# Altium project hand_main_v2.PrjPcb (part 2 of 2)

## Sheet hand_pdn_v2.SchDoc
size 762 x 381 mm; SheetNumber: 2; SheetTotal: 2; SPICEModelCacheLCJNLKZJ: <root> / <DocumentId>LCJNLKZJ</DocumentId> / </root>
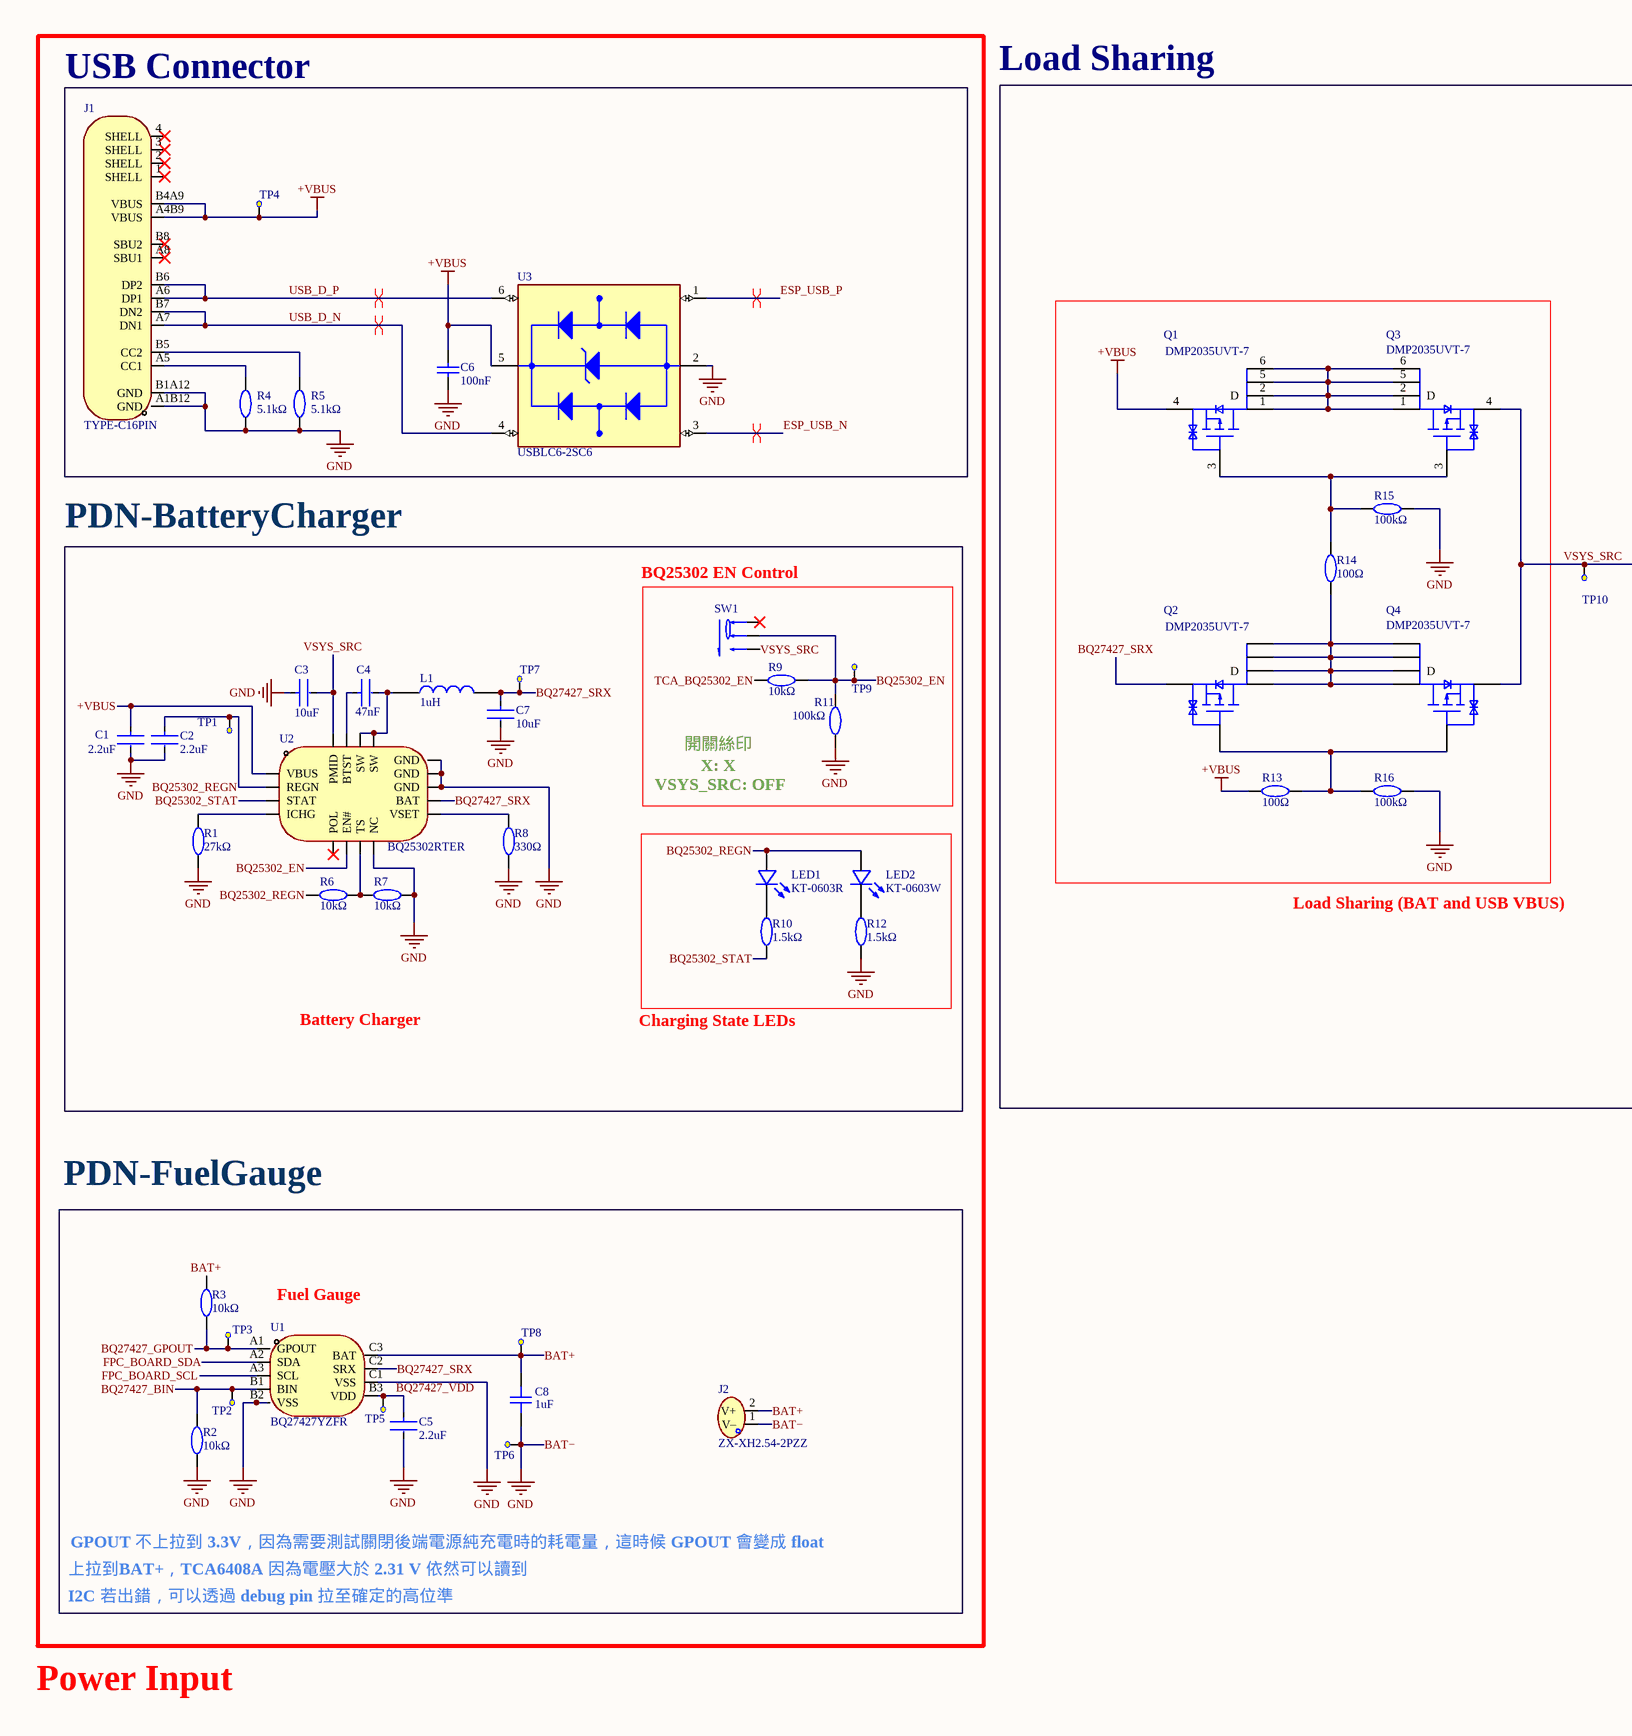
[diagram p3: hand_pdn_v2.SchDoc, left]
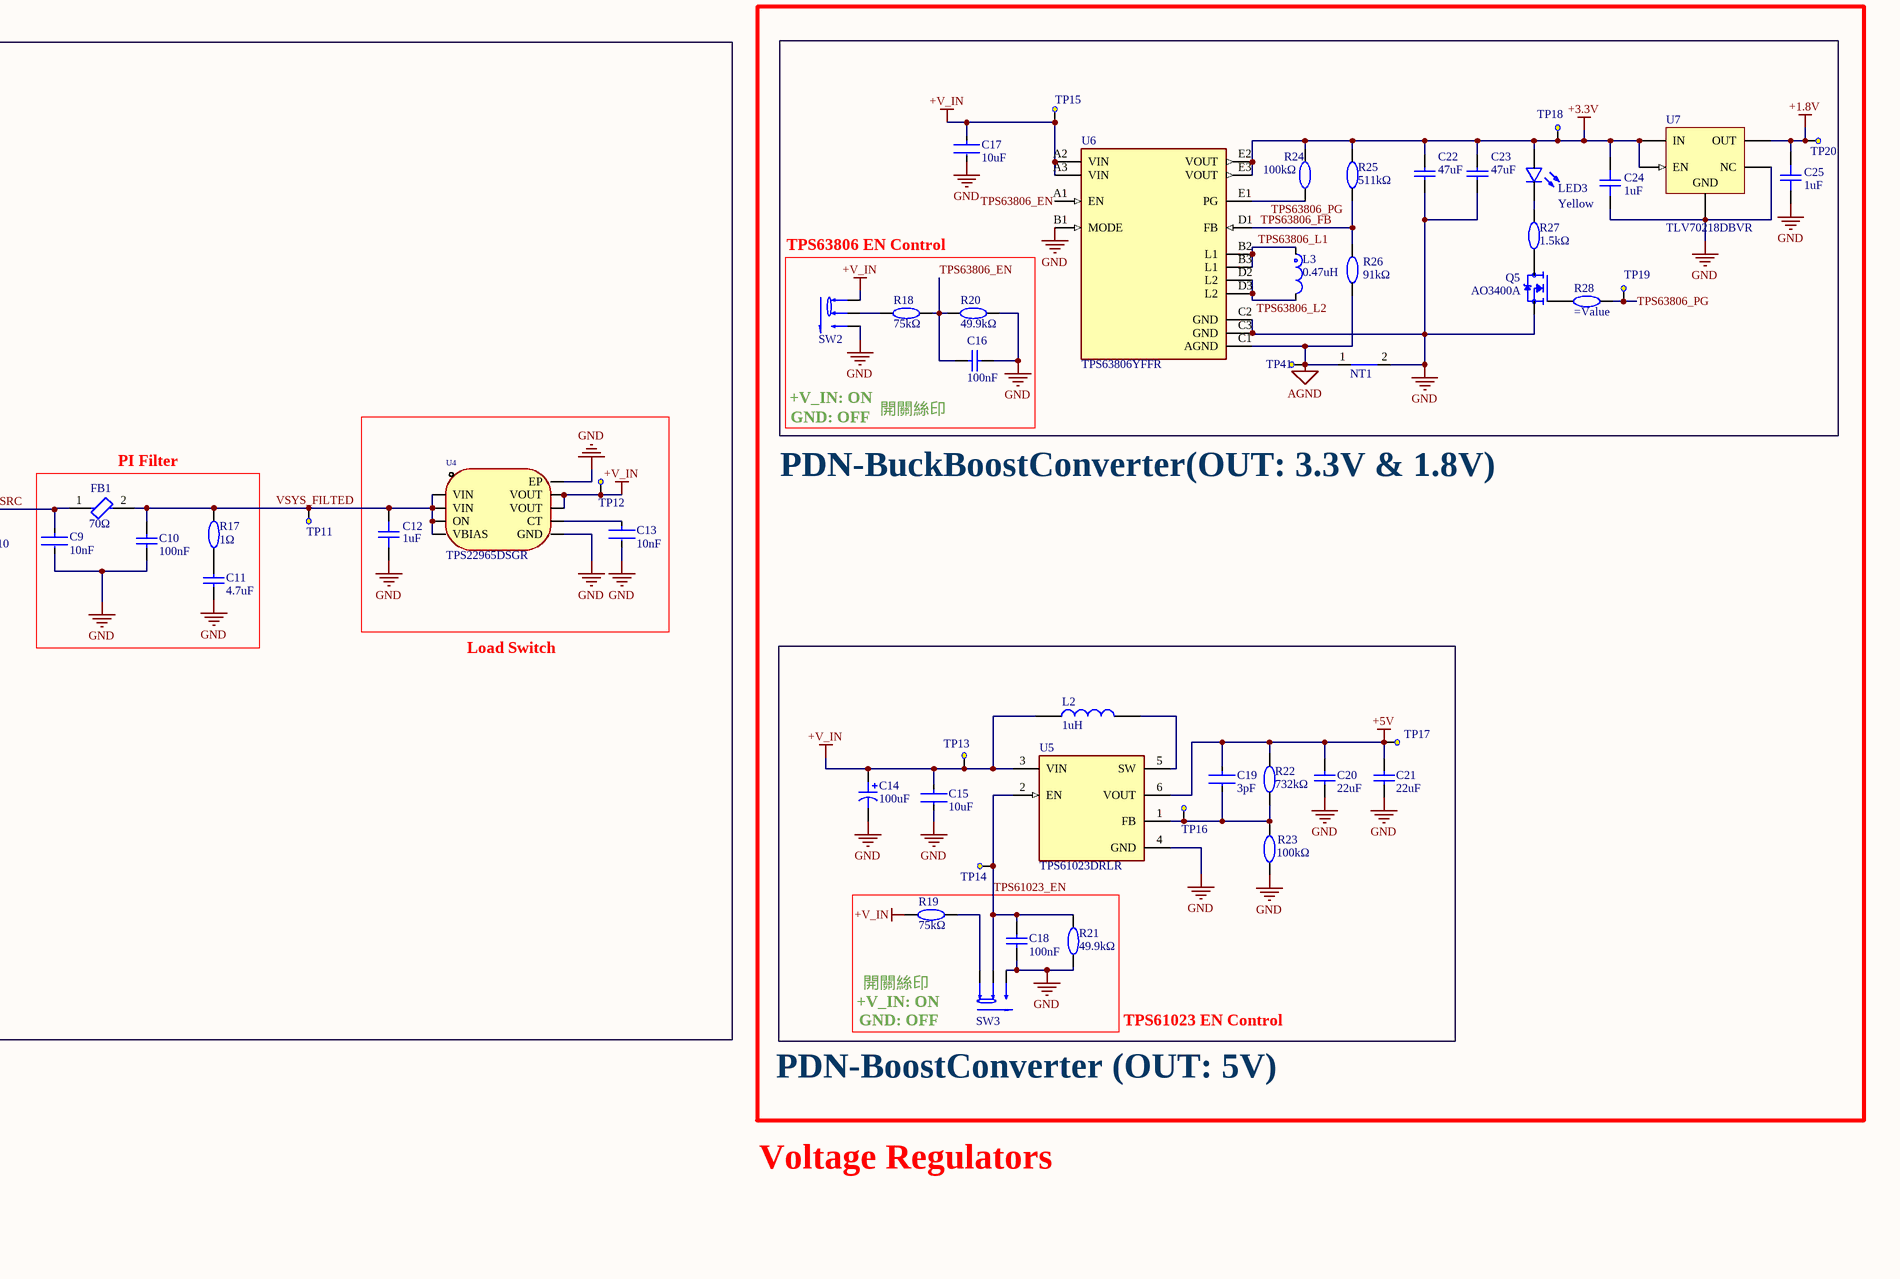
[diagram p4: hand_pdn_v2.SchDoc, right]

### Parts
C1  2.2uF  [FP-CL10-IPC_A]
C2  2.2uF  [FP-CL10-IPC_A]
C3  10uF  [FP-CL10-IPC_A]
C4  47nF  [FP-CL579-IPC_A]
C5  2.2uF  [FP-CL10-IPC_A]
C6  100nF  [CAPC1050X55X23NL05T13]
C7  10uF  [FP-CL10-IPC_A]
C8  1uF  [C0402]
C9  10nF  [FP-CL165-IPC_B]
C10  100nF  [CAPC1050X55X23NL05T13]
C11  4.7uF  [C0603]
C12  1uF  [C0402]
C13  10nF  [FP-CL165-IPC_B]
C14  100uF  [CAP-SMD_BD6.3-L6.6-W6.6-LS7.2-FD]
C15  10uF  [FP-CL10-IPC_A]
C16  100nF  [CAPC1050X55X23NL05T13]
C17  10uF  [FP-CL10-IPC_A]
C18  100nF  [CAPC1050X55X23NL05T13]
C19  3pF  [FP-GJM155-0_05-IPC_C]
C20  22uF  [CAPC2013X140X45ML15T25]
C21  22uF  [CAPC2013X140X45ML15T25]
C22  47uF  [C0805]
C23  47uF  [C0805]
C24  1uF  [C0402]
C25  1uF  [C0402]
FB1  70Ω  [FP-BLM18-0_15-t0_5-d1_2-IPC_B]
J1  TYPE-C16PIN  [USB-C-SMD_TYPE-C16PIN]
J2  ZX-XH2.54-2PZZ  [CONN-TH_2P-P2.50_HX25003-2A]
L1  1uH  [XEL4030101MED]
L2  1uH  [XEL4030101MED]
L3  0.47uH  [FP-XFL4015-MFG]
LED1  KT-0603R  [LED0603-RD]
LED2  KT-0603W  [LED0603-R-RD_WHITE]
LED3  Name: Yellow  [LED0603-RD-YELLOW]  (hidden comment: 19-213/Y2C-CQ2R2L/3T(CY))
NT1  NT  [NT]  (value not drawn)  (net tie, no BOM)
Q1  DMP2035UVT-7  [SOT-26_L3.0-W1.6-P0.95-LS2.8-BL]
Q2  DMP2035UVT-7  [SOT-26_L3.0-W1.6-P0.95-LS2.8-BL]
Q3  DMP2035UVT-7  [SOT-26_L3.0-W1.6-P0.95-LS2.8-BL]
Q4  DMP2035UVT-7  [SOT-26_L3.0-W1.6-P0.95-LS2.8-BL]
Q5  AO3400A  [FP-SOT23-IPC_A]
R1  27kΩ  [R0603]
R2  10kΩ  [R0402]
R3  10kΩ  [R0402]
R4  5.1kΩ  [R0402]
R5  5.1kΩ  [R0402]
R6  10kΩ  [R0402]
R7  10kΩ  [R0402]
R8  330Ω  [R0402]
R9  10kΩ  [R0402]
R10  1.5kΩ  [R0402]
R11  100kΩ  [R0402]
R12  1.5kΩ  [R0402]
R13  100Ω  [R0603]
R14  100Ω  [R0603]
R15  100kΩ  [R0402]
R16  100kΩ  [R0402]
R17  1Ω  [R0805]
R18  75kΩ  [R0603]
R19  75kΩ  [R0603]
R20  49.9kΩ  [R0603]
R21  49.9kΩ  [R0603]
R22  732kΩ  [R0603]
R23  100kΩ  [R0402]
R24  100kΩ  [R0402]
R25  511kΩ  [R0603]
R26  91kΩ  [R0402]
R27  1.5kΩ  [R0402]
R28  (no value)  [R0402]
SW1  MST-22D18G2 3J  [SW-SMD_SHOUHAN_MST-22D18G23J_C2875122]  (value not drawn)
SW2  MST-22D18G2 3J  [SW-SMD_SHOUHAN_MST-22D18G23J_C2875122]  (value not drawn)
SW3  MST-22D18G2 3J  [SW-SMD_SHOUHAN_MST-22D18G23J_C2875122]  (value not drawn)
TP1  Test point  [Test_Point]  (value not drawn)
TP2  Test point  [Test_Point]  (value not drawn)
TP3  Test point  [Test_Point]  (value not drawn)
TP4  Test point  [Test_Point]  (value not drawn)
TP5  Test point  [Test_Point]  (value not drawn)
TP6  Test point  [Test_Point]  (value not drawn)
TP7  Test point  [Test_Point]  (value not drawn)
TP8  Test point  [Test_Point]  (value not drawn)
TP9  Test point  [Test_Point]  (value not drawn)
TP10  Test point  [Test_Point]  (value not drawn)
TP11  Test point  [Test_Point]  (value not drawn)
TP12  Test point  [Test_Point]  (value not drawn)
TP13  Test point  [Test_Point]  (value not drawn)
TP14  Test point  [Test_Point]  (value not drawn)
TP15  Test point  [Test_Point]  (value not drawn)
TP16  Test point  [Test_Point]  (value not drawn)
TP17  Test point  [Test_Point]  (value not drawn)
TP18  Test point  [Test_Point]  (value not drawn)
TP19  Test point  [Test_Point]  (value not drawn)
TP20  Test point  [Test_Point]  (value not drawn)
TP41  Test point  [Test_Point]  (value not drawn)
U1  BQ27427YZFR  [DSBGA-9_L1.6-W1.6-R3-C3-P0.50-TL]
U2  BQ25302RTER  [WQFN-16_L3.0-W3.0-P0.50-BL-EP1.7]
U3  USBLC6-2SC6  [SOT95P280X145-6N]
U4  TPS22965DSGR  [UDFN-8_L2.0-W2.0-P0.50-TL-EP]
U5  TPS61023DRLR  [FP-DRL0006A-MFG]
U6  TPS63806YFFR  [FP-YFF0015-MFG]
U7  TLV70218DBVR  [DBV0005A_M]

### Blocks framed on the sheet
USB Connector: C6 J1 R4 R5 TP4 U3
Load Sharing: C12 C13 Q1-Q4 R13-R16 TP10-TP12 U4
PI Filter: C9-C11 FB1 R17
PDN-BatteryCharger: C1-C4 C7 L1 LED1 LED2 R1 R6-R12 SW1 TP1 TP7 TP9 U2
PDN-FuelGauge: C5 C8 J2 R2 R3 TP2 TP3 TP5 TP6 TP8 U1

### Nets
+1.8V: C25.2 TP20.TP?(Test_point) U7.5(OUT)
+3.3V: C22.2 C23.2 C24.2 LED3.2(A) R24.2 R25.2 TP18.TP?(Test_point) U6.E2(VOUT) U6.E3(VOUT) U7.1(IN) U7.3(EN)
+5V: C19.1 C20.2 C21.2 R22.2 TP17.TP?(Test_point) U5.6(VOUT)
+V_IN: C14.1 C15.1 C17.1 L2.1 R19.1 SW2.1 TP12.TP?(Test_point) TP13.TP?(Test_point) TP15.TP?(Test_point) U4.7(VOUT) U4.8(VOUT) U5.3(VIN) U6.A2(VIN) U6.A3(VIN)
+VBUS: C1.1 C6.2 J1.A4B9(VBUS) J1.B4A9(VBUS) Q1.4(S) R13.2 TP4.TP?(Test_point) U2.1(VBUS) U3.5(VBUS)
AGND: NT1.1 R26.1 TP41.TP?(Test_point) U6.C1(AGND)
BAT+: C8.2 J2.2(V+) R3.2 TP8.TP?(Test_point) U1.C3(BAT)
GND: C1.2 C2.2 C3.1 C5.2 C6.1 C7.2 C8.1 C9.2 C10.1 C11.1 C12.1 C13.2 C14.2 C15.2 C16.1 C17.2 C18.2 C20.1 C21.1 C22.1 C23.1 C24.1 C25.1 J1.A1B12(GND) J1.B1A12(GND) J2.1(V–) NT1.2 Q5.2(S) R1.1 R2.1 R4.1 R5.1 R7.2 R8.1 R11.1 R12.1 R15.1 R16.1 R20.2 R21.1 R23.1 SW2.3 SW3.3 TP6.TP?(Test_point) U1.B2(VSS) U1.C1(VSS) U2.8(NC) U2.11(GND) U2.12(GND) U2.17(GND) U3.2(GND) U4.5(GND) U4.9(EP) U5.4(GND) U6.B1(MODE) U6.C2(GND) U6.C3(GND) U7.2(GND) U7.4(NC)  [also labelled BAT−]
BQ25302_EN: R9.1 R11.2 SW1.2 TP9.TP?(Test_point) U2.6(EN#)
BQ25302_REGN: C2.1 LED1.2(A) LED2.1(A) R6.1 TP1.TP?(Test_point) U2.2(REGN)
BQ25302_STAT: R10.1 U2.3(STAT)
BQ27427_BIN: R2.2 TP2.TP?(Test_point) U1.B1(BIN)
BQ27427_GPOUT: R3.1 TP3.TP?(Test_point) U1.A1(GPOUT)
BQ27427_SRX: C7.1 L1.2 Q2.4(S) TP7.TP?(Test_point) U1.C2(SRX) U2.10(BAT)
BQ27427_VDD: C5.1 TP5.TP?(Test_point) U1.B3(VDD)
ESP_USB_N: U3.3(I/O2_IN)
ESP_USB_P: U3.1(I/O1_IN)
FPC_BOARD_SCL: U1.A3(SCL)
FPC_BOARD_SDA: U1.A2(SDA)
TCA_BQ25302_EN: R9.2
TPS61023_EN: C18.1 R21.2 SW3.2 TP14.TP?(Test_point) U5.2(EN)
TPS63806_EN: C16.2 R18.2 R20.1 U6.A1(EN)
TPS63806_FB: R25.1 R26.2 U6.D1(FB)
TPS63806_L1: L3.1 U6.B2(L1) U6.B3(L1)
TPS63806_L2: L3.2 U6.D2(L2) U6.D3(L2)
TPS63806_PG: R24.1 R28.2 TP19.TP?(Test_point) U6.E1(PG)
USB_D_N: J1.A7(DN1) J1.B7(DN2) U3.4(I/O2_OUT)
USB_D_P: J1.A6(DP1) J1.B6(DP2) U3.6(I/O1_OUT)
VSYS_FILTED: C10.2 C12.2 FB1.2 R17.2 TP11.TP?(Test_point) U4.1(VIN) U4.2(VIN) U4.3(ON) U4.4(VBIAS)
VSYS_SRC: C3.2 C9.1 FB1.1 Q3.4(S) Q4.4(S) SW1.3 TP10.TP?(Test_point) U2.16(PMID)
NetC4_1: C4.1 U2.15(BTST)
NetC4_2: C4.2 L1.1 U2.13(SW) U2.14(SW)
NetC11_2: C11.2 R17.1
NetC13_1: C13.1 U4.6(CT)
NetC19_2: C19.2 R22.1 R23.2 TP16.TP?(Test_point) U5.1(FB)
NetJ1_A5: J1.A5(CC1) R4.2
NetJ1_B5: J1.B5(CC2) R5.2
NetL2_2: L2.2 U5.5(SW)
NetLED1_1: LED1.1(K) R10.2
NetLED2_2: LED2.2(K) R12.2
NetLED3_1: LED3.1(C) R27.2
NetQ1_1: Q1.1(D) Q1.2(D) Q1.5(D) Q1.6(D) Q3.1(D) Q3.2(D) Q3.5(D) Q3.6(D)
NetQ1_3: Q1.3(G) Q3.3(G) R14.2 R15.2
NetQ2_1: Q2.1(D) Q2.2(D) Q2.5(D) Q2.6(D) Q4.1(D) Q4.2(D) Q4.5(D) Q4.6(D) R14.1
NetQ2_3: Q2.3(G) Q4.3(G) R13.1 R16.2
NetQ5_1: Q5.1(G) R28.1
NetQ5_3: Q5.3(D) R27.1
NetR1_2: R1.2 U2.4(ICHG)
NetR6_2: R6.2 R7.1 U2.7(TS)
NetR8_2: R8.2 U2.9(VSET)
NetR18_1: R18.1 SW2.2
NetR19_2: R19.2 SW3.1

Not connected (* = marked no-connect by the designer): J1 1(SHELL)* 2(SHELL)* 3(SHELL)* 4(SHELL)* A8(SBU1)* B8(SBU2)*; SW1 1*; U2 5(POL)*

### Layout directives
differential pair: ESP_USB_N, ESP_USB_P, USB_D_N, USB_D_P

### Notes on the sheet
- TPS63806 EN Control
- +V_IN: ON
- GND: OFF
- 開關絲印
- (near SW1) BQ25302 EN Control
- PDN-BuckBoostConverter(OUT: 3.3V & 1.8V)
- Load Switch
- VSYS_SRC: OFF
- X: X
- Load Sharing (BAT and USB VBUS)
- Battery Charger
- Charging State LEDs
- TPS61023 EN Control
- PDN-BoostConverter (OUT: 5V)
- Voltage Regulators
- Fuel Gauge
- I2C 若出錯，可以透過 debug pin 拉至確定的高位準
- 上拉到BAT+，TCA6408A 因為電壓大於 2.31 V 依然可以讀到
- GPOUT 不上拉到 3.3V，因為需要測試關閉後端電源純充電時的耗電量，這時候 GPOUT 會變成 float
- Power Input

### Library data of the parts
C1 C2 C5 = CL10A225KO8NNNC: Cap Ceramic 2.2uF 16V X5R ±10% Pad SMD 0603 +85°C T/R; Case Code (Metric): 1608; Height: 0.8mm; Case/Package: 0603; Depth: 0.8mm; Capacitance: 2.2uF; Voltage Rating: 16V; Case Code (Imperial): 0603; Length: 1.6mm; Packaging: Tape and Reel; Material: Ceramic; Lead Free: Lead Free; Max Operating Temperature: 85°C; Contact Plating: Tin; Thickness: 0.035inch; Radiation Hardening: No; Tolerance: 10%; Min Operating Temperature: -55°C; Voltage: 16V; Dielectric: X5R; Mount: Surface Mount; Package Quantity: 4000; Width: 0.031inch; Voltage Rating (DC): 16V
C3 C7 C15 C17 = CL10A106MA8NRNC: Cap Ceramic 10uF 25V X5R ±20% Pad SMD 0603 +85°C T/R; Width: 0.031inch; Voltage Rating: 25V; Length: 0.063inch; Case Code (Metric): 1608; Dielectric: X5R; Termination: Wraparound; Capacitance: 10uF; Lead Free: Lead Free; Mount: Surface Mount; Package Quantity: 1; Case Code (Imperial): 0603; Thickness: 0.035inch; Packaging: Tape and Reel; Contact Plating: Tin; Min Operating Temperature: -55°C; Tolerance: 20%; Max Operating Temperature: 85°C; Case/Package: 0603
C4 = CL05B473KO5NNNC: Cap Ceramic 47nF 16V X7R ±10% SMD 0402 +125°C Paper T/R; Voltage Rating (DC): 16V; Mount: Surface Mount; Max Operating Temperature: 125°C; Radiation Hardening: No; Voltage: 16V; Capacitance: 47nF; Length: 1mm; Package Quantity: 1; Tolerance: 10%; Width: 0.02inch; Case/Package: 0402; Case Code (Metric): 1005; Height: 0.5mm; Packaging: Tape and Reel; Depth: 0.5mm; Lead Free: Lead Free; Min Operating Temperature: -55°C; Case Code (Imperial): 0402; Voltage Rating: 16V; Contact Plating: Tin; Dielectric: X7R; Thickness: 0.022inch
C6 C10 C16 C18 = CL05B104KO5NNNC: Chip Capacitor, 100 nF, +/- 10%, 16 V, -55 to 125 degC, 0402 (1005 Metric), RoHS, Tape and Reel; Manufacturer: Samsung Electro-Mechanics; Capacitance: 100000pF; Dielectric: X7R; Rated Voltage: 16V; Case Size/Dimension: 0402; Tolerance (%): ±10%; Manufacturer URL: http://www.samsungsem.com/global/index.jsp; Datasheet URL: https://datasheet.ciiva.com/29198/458718-da-01-en-vs-kondensator-0402-29198423.pdf; Datasheet Version: Nov-10
C8 C12 C24 C25 = CL05A105KA5NQNC: MLCC, 1 uF, 25 V, ± 10%, X5R, 0402 [1005 Metric]; Manufacturer: SAMSUNG(三星); Add into BOM: yes; Voltage Rated: 25V; Symbol: CL05A105KA5NQNC; Device: CL05A105KA5NQNC; LCSC Part Name: 1uF ±10% 25V; Supplier Part: C52923; Manufacturer Part: CL05A105KA5NQNC; Supplier Footprint: 0402; JLCPCB Part Class: Basic Part; Datasheet: https://atta.szlcsc.com/upload/public/pdf/source/20160218/1457707763339.pdf; Supplier: LCSC; Convert to PCB: yes; Value: 1uF; Tolerance: ±10%; Temperature Coefficient: X5R; Name: 1uF
C9 C13 = CL05B103KB5NNNC: Cap Ceramic 10nF 50V X7R ±10% SMD 0402 +125°C Paper T/R; Depth: 0.5mm; Length: 1mm; Lead Free: Lead Free; Case Code (Metric): 1005; Width: 0.02inch; Min Operating Temperature: -55°C; Thickness: 0.022inch; Package Quantity: 1; Mount: Surface Mount; Height: 0.5mm; Voltage: 50V; Material: Ceramic; Tolerance: 10%; Case Code (Imperial): 0402; Radiation Hardening: No; Case/Package: 0402; Max Operating Temperature: 125°C; Voltage Rating (DC): 50V; Contact Plating: Tin; Packaging: Tape and Reel; Voltage Rating: 50V; Capacitance: 10nF; Dielectric: X7R
C11 = CL10A475KO8NNNC: Multilayer Ceramic Capacitor, 4.7 uF, 16 V, ± 10%, X5R, 0603 [1608 Metric]; Manufacturer: SAMSUNG(三星); Add into BOM: yes; Voltage Rated: 16V; Symbol: CL10A475KO8NNNC; Device: CL10A475KO8NNNC; Supplier: LCSC; Manufacturer Part: CL10A475KO8NNNC; Value: 4.7uF; Supplier Part: C19666; JLCPCB Part Class: Basic Part; LCSC Part Name: 4.7uF ±10% 16V; Supplier Footprint: 0603; Datasheet: https://atta.szlcsc.com/upload/public/pdf/source/20160218/1457707763339.pdf; Convert to PCB: yes; Tolerance: ±10%; Temperature Coefficient: X5R; Name: 4.7uF
C14 = RVE100UF16V67RV0046: 100uF 16V SMD, D6.3xL5.4mm Aluminum Electrolytic Capacitors - SMD ROHS; Manufacturer: KNSCHA(科尼盛); Add into BOM: yes; Tolerance: ±20%; Ripple Current: 170mA@120Hz; Equivalent Series Resistance(ESR): 850mΩ@100kHz; φD: 6.3mm; L: 5.4mm; Lifetime @ Temp: 2000hrs@105℃; Symbol: RVE100UF16V67RV0046; Device: RVE100UF16V67RV0046; Supplier: LCSC; Supplier Part: C2904878; Manufacturer Part: RVE100UF16V67RV0046; Value: 100uF; JLCPCB Part Class: 扩展库; LCSC Part Name: 100uF ±20% 16V; Supplier Footprint: SMD,D6.3xL5.4mm; Datasheet: https://atta.szlcsc.com/upload/public/pdf/source/20211014/E793867481A07AC3B19BA2A562D53862.pdf; Convert to PCB: yes; Rated Voltage: 16V; Operating Temperature: -55℃~+105℃; Name: 100uF
C19 = GJM1555C1H3R0WB01D: Multi-Layer Ceramic Capacitor 3pF C0G  ±0.05pF 0402 Paper T/R; Voltage Rating: 50V; Case Code (Imperial): 0402; Capacitance: 3pF; Radiation Hardening: No; Max Operating Temperature: 125°C; Case/Package: 0402; Length: 1mm; Depth: 0.5mm; Min Operating Temperature: -55°C; Mount: Surface Mount; Dielectric: C0G; Thickness: 0.022inch; Width: 0.5mm; Voltage Rating (DC): 50V; Case Code (Metric): 1005; Height: 0.5mm; Packaging: Tape and Reel; Termination: SMD/SMT; Package Quantity: 10000
C20 C21 = CL21A226MAQNNNE: Multi-layer Ceramic Capacitor, 22 uF, -55 to 85 degC, 2-Pin SMD (0805), RoHS, Tape and Reel; Manufacturer: Samsung Electro-Mechanics; Voltage - Rated: 25V; Other Names: 1276-2908-2; Capacitance: 22µF; Featured Product: Multi-LayerCeramicCapacitors; Product Training Modules: HighCapMLCCFamily; Temperature Coefficient: X5R; Tolerance: ±20%; Online Catalog: CLSeries,HighCapacitance; Applications: GeneralPurpose; RoHS Information: MLCCRoHS2Compliance; Height - Seated (Max): -; Lead Style: -; Lead Spacing: -; Datasheet URL: http://datasheet.octopart.com/CL21A226MAQNNNE-Samsung-datasheet-48647558.pdf; Size / Dimension: 0.079"Lx0.049"W(2.00mmx1.25mm); Thickness (Max): 0.055"(1.40mm); Family: CeramicCapacitors; Package Description: 2-Pin Surface Mount Device, Body 2.0 x 1.25 mm; Datasheet Version: 07/2015; Packaging: Tape&Reel(TR); Manufacturer URL: http://www.samsungsem.com/global/index.jsp; Ratings: -; Package / Case: 0805(2012Metric); Standard Package: 2,000; Mounting Type: SurfaceMount,MLCC; Mounting Technology: SurfaceMount; Category: Capacitors; Package Reference: 0805; Series: CL; Features: -; Operating Temperature: -55°C~85°C
C22 C23 = CL21A476MQYNNNE: MLCC, 47 uF, 6.3 V, ± 20%, X5R, 0805 [2012 Metric]; Manufacturer: SAMSUNG(三星); Add into BOM: yes; Voltage Rated: 6.3V; Symbol: CL21A476MQYNNNE; Device: CL21A476MQYNNNE; Supplier: LCSC; Manufacturer Part: CL21A476MQYNNNE; Value: 47uF; Supplier Part: C16780; JLCPCB Part Class: Basic Part; LCSC Part Name: 47uF ±20% 6.3V; Supplier Footprint: 0805; Datasheet: https://atta.szlcsc.com/upload/public/pdf/source/20160218/1457707763339.pdf; Convert to PCB: yes; Tolerance: ±20%; Temperature Coefficient: X5R; Name: 47uF
FB1 = BLM18SG700TZ1D: Chip Ferrite Bead, 0603, 70Ω @ 100MHz, 25%, 0.02Ω, 4A; RoHS Compliant: Yes
J1 = TYPE-C16PIN: USB Type-C 16 pins connector; Manufacturer: SHOU HAN(首韩); Add into BOM: yes; Gender: 母; Number of Ports: 1; Number of Contacts: 16P; Current Rating - Power (Max): 3A; Symbol: TYPE-C16PIN; Device: TYPE-C16PIN; Supplier: LCSC; Supplier Part: C393939; Manufacturer Part: TYPE-C16PIN; JLCPCB Part Class: Extended Part; LCSC Part Name: Type-C 母 卧贴; Supplier Footprint: SMD; Datasheet: https://atta.szlcsc.com/upload/public/pdf/source/20190521/C393939_7B9043D4CF1026AF443AB60D91FBCD5C.pdf; Convert to PCB: yes; Connector Type: Type-C; Standard: -; Mounting Style: 卧贴; Operating Temperature Range: -40℃~+85℃; Name: TYPE-C16PIN
J2 = ZX-XH2.54-2PZZ: XH-2.54 2 Pin, through hole; Manufacturer: Megastar(兆星); Add into BOM: yes; Pins Structure: 1x2P; Pitch: 2.54mm; Reference Series: XH; Number of PINs Per Row: 2; Current Rating (Max): 3A; Symbol: ZX-XH2.54-2PZZ; Device: ZX-XH2.54-2PZZ; Supplier: LCSC; Supplier Part: C7429632; Manufacturer Part: ZX-XH2.54-2PZZ; JLCPCB Part Class: 扩展库; LCSC Part Name: ZX-XH2.54-2PZZ; Supplier Footprint: 插件,P=2.54mm; Datasheet: https://atta.szlcsc.com/upload/public/pdf/source/20230619/19BA6947230AA44A04D3EDD65E618FD0.pdf; Convert to PCB: yes; Mounting Style: 直插; Number of Pins: 2P; Number of Rows: 1; Row Spacing: -; Contact Material: 黄铜; Contact Plating: 锡; Operating Temperature Range: -25℃~+85℃; Name: ZX-XH2.54-2PZZ
L1 L2 = XEL4030-102MEC: Power inductor, shielded, 20% tol, SMT, RoHS, halogen-free; Manufacturer_Name: COILCRAFT; Datasheet Link: https://www.coilcraft.com/pdfs/xel4030.pdf; Height: 3.2mm; Manufacturer_Part_Number: XEL4030-102MEC; Mouser Part Number: 994-XEL4030-102MEC; Mouser Price/Stock: https://www.mouser.co.uk/ProductDetail/Coilcraft/XEL4030-102MEC?qs=chTDxNqvsynxP6L4IWrGOQ%3D%3D; Value: 1uH
L3 = XFL4015-471MEC: Shielded Power Fixed Inductor 0.47µH 11.2A 8.36mOhm AECQ2, SFR 89MHz; DC Resistance (DCR): 8.36mR; Inductance: 470nH; Test Frequency: 100kHz; Tolerance: 20%; Core Material: Composite; Width: 4.3mm; Shielding: Shielded; Length: 4.3mm; Max DC Current: 11.2A; Series: XFL4015; RoHS Compliant: Yes; Min Operating Temperature: -40°C; Packaging: Tape and Reel; Self Resonant Frequency: 89MHz; Termination: SMD/SMT; Max Operating Temperature: 125°C; Height: 1.6mm; Package Quantity: 1000; Lead Free: Contains Lead
LED1 = KT-0603R: LED, Red 0603; Manufacturer: KENTO; Add into BOM: yes; Emitted Color: 红色; Symbol: KT-0603R; Device: KT-0603R; LCSC Part Name: 0603 红灯 高亮; Supplier Part: C2286; Manufacturer Part: KT-0603R; Supplier Footprint: 0603; JLCPCB Part Class: 基础库; Datasheet: https://atta.szlcsc.com/upload/public/pdf/source/20160616/1466072038404.pdf; Supplier: LCSC; Convert to PCB: yes; Power Dissipation: -; Forward Current: -; Dominant Wavelength: -; Peak Wavelength: -; Diode Configuration: -; Lens Color: -; Color Temperature: -; Viewing Angle: -; Mounting Sytle: -; Operating Temperature: -40℃~+85℃; Name: KT-0603R
LED2 = KT-0603W: LED, White 0603; Manufacturer: KENTO; Symbol: 0603White light_C2290; Add into BOM: yes; Emitted Color: 白色; Device: KT-0603W; LCSC Part Name: 0603 白灯 高亮; Supplier Part: C2290; Manufacturer Part: KT-0603W; Supplier Footprint: 0603; JLCPCB Part Class: 基础库; Datasheet: https://atta.szlcsc.com/upload/public/pdf/source/20221101/4C23D5C85BA051E44A00B833D0A41468.pdf; Supplier: LCSC; Convert to PCB: yes; Name: KT-0603W
LED3 = 19-213/Y2C-CQ2R2L/3T(CY): LED, Yellow 0603; Manufacturer: EVERLIGHT(亿光); Add into BOM: yes; Emitted Color: 黄灯; Lens Color: 无色透明; Dominant Wavelength: 585.5nm~591.5nm; Peak Wavelength: 591nm; Forward Current: 20mA; Power Dissipation: 60mW; Viewing Angle: 120°; Symbol: 19-213/Y2C-CQ2R2L/3T(CY); Device: 19-213/Y2C-CQ2R2L/3T(CY); LCSC Part Name: 黄灯; Supplier Part: C72038; Manufacturer Part: 19-213/Y2C-CQ2R2L/3T(CY); Supplier Footprint: 0603; JLCPCB Part Class: 基础库; Datasheet: https://atta.szlcsc.com/upload/public/pdf/source/20160507/1462613613586.pdf; Supplier: LCSC; Convert to PCB: yes; Diode Configuration: -; Color Temperature: -; Mounting Sytle: -; Operating Temperature: -40℃~+85℃; Value: *; Info: Yellow
NT1 = NetTie_SMD
Q1-Q4 = DMP2035UVT-7: P-Channel 20 V 35 mOhm Surface Mount Enhancement Mode Mosfet - TSOT26-6; Manufacturer: DIODES(美台); Add into BOM: yes; Type: 1个P沟道; Drain Source Voltage (Vdss): 20V; Continuous Drain Current (Id): 6A; Power Dissipation (Pd): 1.2W; Drain Source On Resistance (RDS(on)@Vgs,Id): 35mΩ@4.5V,4A; Gate Threshold Voltage (Vgs(th)@Id): 1.5V@250uA; Total Gate Charge (Qg@Vgs): 23.1nC@4.5V; Input Capacitance (Ciss@Vds): 2.4nF@10V; Symbol: DMP2035UVT-7; Device: DMP2035UVT-7; LCSC Part Name: 1个P沟道 耐压:20V 电流:6A; Supplier Part: C260934; Manufacturer Part: DMP2035UVT-7; Supplier Footprint: TSOT-23-6; JLCPCB Part Class: 扩展库; Datasheet: https://atta.szlcsc.com/upload/public/pdf/source/20180725/C260934_EBD02C3987C7A81956B20CBEFFB2DB19.pdf; Supplier: LCSC; Convert to PCB: yes; Operating Temperature: -55℃~+150℃@(Tj); Name: DMP2035UVT-7
Q5 = AO3400A: MOSFET N-CH 30V 5.7A SOT23, C20917, Vth from 0.65 - 1.45 V; Input Capacitance: 630pF; Number of Elements: 1; Rds On Max: 26.5mR; Max Power Dissipation: 1.4W; Gate to Source Voltage (Vgs): 12V; Min Operating Temperature: -55°C; Lead Free: Lead Free; Number of Pins: 3; Drain to Source Voltage (Vdss): 30V; Case/Package: SOT-23; Mount: Surface Mount; Continuous Drain Current (ID): 5.7A; Radiation Hardening: No; Packaging: Tape and Reel; Max Operating Temperature: 150°C; Power Dissipation: 1.4W
R1 = 0603WAF2702T5E: Resistor, Res Thick Film 0603 27K Ohm 1% 0.1W ±100ppm/°C Pad SMD T/R; Manufacturer: UNI-ROYAL(厚声); Add into BOM: yes; Power(Watts): 100mW; Overload Voltage (Max): 75V; Temperature Coefficient: ±100ppm/℃; Symbol: 0603WAF2702T5E; Device: 0603WAF2702T5E; Supplier: LCSC; Manufacturer Part: 0603WAF2702T5E; Supplier Part: C22967; Value: 27kΩ; JLCPCB Part Class: 基础库; LCSC Part Name: 27kΩ ±1% 100mW 厚膜电阻; Supplier Footprint: 0603; Datasheet: https://atta.szlcsc.com/upload/public/pdf/source/20200306/C422600_1E6D84923E4A46A82E41ADD87F860B5C.pdf; Convert to PCB: yes; Type: 厚膜电阻; Tolerance: ±1%; Operating Temperature Range: -55℃~+155℃; Name: 27kΩ
R2 R3 R6 R7 R9 = 0402WGF1002TCE: Resistor, Res Thick Film 0402 10K Ohm 1% 0.063W(1/16W) ±100ppm/°C Pad SMD T/R; Manufacturer: UNI-ROYAL(厚声); Add into BOM: yes; Power(Watts): 62.5mW; Overload Voltage (Max): 50V; Temperature Coefficient: ±100ppm/℃; Symbol: 0402WGF1002TCE; Device: 0402WGF1002TCE; Supplier: LCSC; Manufacturer Part: 0402WGF1002TCE; Supplier Part: C25744; Value: 10kΩ; JLCPCB Part Class: 基础库; LCSC Part Name: 10kΩ ±1% 62.5mW 厚膜电阻; Supplier Footprint: 0402; Datasheet: https://atta.szlcsc.com/upload/public/pdf/source/20200306/C422600_1E6D84923E4A46A82E41ADD87F860B5C.pdf; Convert to PCB: yes; Type: 厚膜电阻; Tolerance: ±1%; Operating Temperature Range: -55℃~+155℃; Name: 10kΩ
R4 R5 = 0402WGF5101TCE: Resistor, 0402 1% 5K1; Power Rating: 0.0625W; Resistance: 5.1kohm; Tolerance, Resistance: ± 1%; Series: MC;...  0.004; Manufacturer: UNI-ROYAL(厚声); Add into BOM: yes; Power(Watts): 62.5mW; Overload Voltage (Max): 50V; Temperature Coefficient: ±100ppm/℃; Symbol: 0402WGF5101TCE; Device: 0402WGF5101TCE; Supplier: LCSC; Manufacturer Part: 0402WGF5101TCE; Supplier Part: C25905; Value: 5.1kΩ; JLCPCB Part Class: Basic Part; LCSC Part Name: 5.1kΩ ±1% 62.5mW 厚膜电阻; Supplier Footprint: 0402; Datasheet: https://atta.szlcsc.com/upload/public/pdf/source/20200306/C422600_1E6D84923E4A46A82E41ADD87F860B5C.pdf; Convert to PCB: yes; Tolerance: ±1%; Type: 厚膜电阻; Operating Temperature Range: -55℃~+155℃; Name: 5.1kΩ
R8 = 0402WGF3300TCE: Resistor, Res Thick Film 0402 330 Ohm 1% 0.063W(1/16W) ±100ppm/°C Pad SMD T/R; Manufacturer: UNI-ROYAL(厚声); Add into BOM: yes; Power(Watts): 62.5mW; Overload Voltage (Max): 50V; Temperature Coefficient: ±100ppm/℃; Symbol: 0402WGF3300TCE; Device: 0402WGF3300TCE; Supplier: LCSC; Manufacturer Part: 0402WGF3300TCE; Supplier Part: C25104; Value: 330Ω; JLCPCB Part Class: Basic Part; LCSC Part Name: 330Ω ±1% 62.5mW 厚膜电阻; Supplier Footprint: 0402; Datasheet: https://atta.szlcsc.com/upload/public/pdf/source/20200306/C422600_1E6D84923E4A46A82E41ADD87F860B5C.pdf; Convert to PCB: yes; Type: 厚膜电阻; Tolerance: ±1%; Operating Temperature Range: -55℃~+155℃; Name: 330Ω
R10 R12 R27 = 0402WGF1501TCE: Resistor, Res Thick Film 0402 1.5K Ohm 1% 0.063W(1/16W) ±100ppm/°C Pad SMD T/R; Manufacturer: UNI-ROYAL(厚声); Add into BOM: yes; Power(Watts): 62.5mW; Overload Voltage (Max): 50V; Temperature Coefficient: ±100ppm/℃; Symbol: 0402WGF1501TCE; Device: 0402WGF1501TCE; Supplier: LCSC; Manufacturer Part: 0402WGF1501TCE; Supplier Part: C25867; Value: 1.5kΩ; JLCPCB Part Class: 基础库; LCSC Part Name: 1.5kΩ ±1% 62.5mW 厚膜电阻; Supplier Footprint: 0402; Datasheet: https://atta.szlcsc.com/upload/public/pdf/source/20200306/C422600_1E6D84923E4A46A82E41ADD87F860B5C.pdf; Convert to PCB: yes; Type: 厚膜电阻; Tolerance: ±1%; Operating Temperature Range: -55℃~+155℃; Name: 1.5kΩ
R11 R15 R16 R23 R24 = 0402WGF1003TCE: Resistor, Res Thick Film 0402 100K Ohm 1% 0.063W(1/16W) ±100ppm/°C Pad SMD T/R; Manufacturer: UNI-ROYAL(厚声); Add into BOM: yes; Power(Watts): 62.5mW; Overload Voltage (Max): 50V; Temperature Coefficient: ±100ppm/℃; Symbol: 0402WGF1003TCE; Device: 0402WGF1003TCE; Supplier: LCSC; Manufacturer Part: 0402WGF1003TCE; Supplier Part: C25741; Value: 100kΩ; JLCPCB Part Class: Basic Part; LCSC Part Name: 100kΩ ±1% 62.5mW 厚膜电阻; Supplier Footprint: 0402; Datasheet: https://atta.szlcsc.com/upload/public/pdf/source/20200306/C422600_1E6D84923E4A46A82E41ADD87F860B5C.pdf; Convert to PCB: yes; Type: 厚膜电阻; Tolerance: ±1%; Operating Temperature Range: -55℃~+155℃; Name: 100kΩ
R13 R14 = 0603WAF1000T5E: Resistor, Res Thick Film 0603 100 Ohm 1% 0.1W(1/10W) ±200ppm/°C Pad SMD T/R; Manufacturer: UNI-ROYAL(厚声); Add into BOM: yes; Power(Watts): 100mW; Overload Voltage (Max): 75V; Temperature Coefficient: ±200ppm/℃; Symbol: 0603WAF1000T5E; Device: 0603WAF1000T5E; LCSC Part Name: 100Ω ±1% 100mW 厚膜电阻; Supplier Part: C22775; Manufacturer Part: 0603WAF1000T5E; Supplier Footprint: 0603; JLCPCB Part Class: 基础库; Datasheet: https://atta.szlcsc.com/upload/public/pdf/source/20200306/C422600_1E6D84923E4A46A82E41ADD87F860B5C.pdf; Supplier: LCSC; Convert to PCB: yes; Type: 厚膜电阻; Value: 100Ω; Tolerance: ±1%; Operating Temperature Range: -55℃~+155℃; Name: 100Ω
R17 = 0805W8F100KT5E: Resistor, Thick Film 0805 1 Ohm 1% 0.125W(1/8W) ±400ppm/°C Pad SMD T/R, working temperature range -55°C ~ +155°C, maximum operating voltage 150V.; Manufacturer: UNI-ROYAL(厚声); Add into BOM: yes; Power(Watts): 125mW; Overload Voltage (Max): 150V; Temperature Coefficient: ±400ppm/℃; Symbol: 0805W8F100KT5E; Device: 0805W8F100KT5E; Supplier: LCSC; Manufacturer Part: 0805W8F100KT5E; Supplier Part: C25271; Value: 1Ω; JLCPCB Part Class: 基础库; LCSC Part Name: 1Ω ±1% 125mW 厚膜电阻; Supplier Footprint: 0805; Datasheet: https://atta.szlcsc.com/upload/public/pdf/source/20200306/C422600_1E6D84923E4A46A82E41ADD87F860B5C.pdf; Convert to PCB: yes; Type: 厚膜电阻; Tolerance: ±1%; Operating Temperature Range: -55℃~+155℃; Name: 1Ω
R18 R19 = 0603WAF7502T5E: Resistor, Res Thick Film 0603 75k Ohm 1% 0.1W(1/10W) ±100ppm/°C Pad SMD T/R; Manufacturer: UNI-ROYAL(厚声); Add into BOM: yes; Power(Watts): 100mW; Overload Voltage (Max): 75V; Temperature Coefficient: ±100ppm/℃; Symbol: 0603WAF7502T5E; Device: 0603WAF7502T5E; Supplier: LCSC; Manufacturer Part: 0603WAF7502T5E; Supplier Part: C23242; Value: 75kΩ; JLCPCB Part Class: Basic Part; LCSC Part Name: 75kΩ ±1% 100mW 厚膜电阻; Supplier Footprint: 0603; Datasheet: https://atta.szlcsc.com/upload/public/pdf/source/20200306/C422600_1E6D84923E4A46A82E41ADD87F860B5C.pdf; Convert to PCB: yes; Type: 厚膜电阻; Tolerance: ±1%; Operating Temperature Range: -55℃~+155℃; Name: 75kΩ
R20 R21 = 0603WAF4992T5E: Resistor, Res Thick Film 0603 49.9k Ohm 1% 0.1W(1/10W) ±100ppm/°C Pad SMD T/R; Manufacturer: UNI-ROYAL(厚声); Add into BOM: yes; Power(Watts): 100mW; Overload Voltage (Max): 75V; Temperature Coefficient: ±100ppm/℃; Symbol: 0603WAF4992T5E; Device: 0603WAF4992T5E; Supplier: LCSC; Manufacturer Part: 0603WAF4992T5E; Supplier Part: C23184; Value: 49.9kΩ; JLCPCB Part Class: Basic Part; LCSC Part Name: 49.9kΩ ±1% 100mW 厚膜电阻; Supplier Footprint: 0603; Datasheet: https://atta.szlcsc.com/upload/public/pdf/source/20200306/C422600_1E6D84923E4A46A82E41ADD87F860B5C.pdf; Convert to PCB: yes; Type: 厚膜电阻; Tolerance: ±1%; Operating Temperature Range: -55℃~+155℃; Name: 49.9kΩ
R22 = RC0603FR-07732KL: RES SMD 732K OHM 1% 1/10W 0603; Manufacturer: YAGEO(国巨); Add into BOM: yes; Power(Watts): 100mW; Overload Voltage (Max): 75V; Temperature Coefficient: ±100ppm/℃; Symbol: RC0603FR-07732KL; Device: RC0603FR-07732KL; LCSC Part Name: 厚膜电阻 732kΩ ±1% 100mW; Supplier Part: C246003; Manufacturer Part: RC0603FR-07732KL; Supplier Footprint: 0603; JLCPCB Part Class: 扩展库; Datasheet: https://atta.szlcsc.com/upload/public/pdf/source/20181031/C326976_E9901E35333D136A19B6CE377E889A82.pdf; Supplier: LCSC; Convert to PCB: yes; Type: 厚膜电阻; Value: 732kΩ; Tolerance: ±1%; Operating Temperature Range: -55℃~+155℃; Name: 732kΩ
R25 = RC0603FR-07511KL: Resistor, Res Thick Film 0402 511k Ohm 1% 0.1W(1/10W) ±100ppm/°C Pad SMD T/R; Manufacturer: YAGEO(国巨); Add into BOM: yes; Power(Watts): 100mW; Overload Voltage (Max): 75V; Temperature Coefficient: ±100ppm/℃; Symbol: RC0603FR-07511KL; Device: RC0603FR-07511KL; LCSC Part Name: 厚膜电阻 511kΩ ±1% 100mW; Supplier Part: C188257; Manufacturer Part: RC0603FR-07511KL; Supplier Footprint: 0603; JLCPCB Part Class: 扩展库; Datasheet: https://atta.szlcsc.com/upload/public/pdf/source/20180316/70C0E2BDAE7FCC62C531A5A58D202EE1.pdf; Supplier: LCSC; Convert to PCB: yes; Type: 厚膜电阻; Value: 511kΩ; Tolerance: ±1%; Operating Temperature Range: -55℃~+155℃; Name: 511kΩ
R26 = AC0402FR-0791KL: SMD Chip Resistor, 91 kOhm, ± 1%, 63 mW, 0402 [1005 Metric], Thick Film, General Purpose; Manufacturer: YAGEO(国巨); Add into BOM: yes; Power(Watts): 62.5mW; Overload Voltage (Max): 50V; Temperature Coefficient: ±100ppm/℃; Symbol: AC0402FR-0791KL; Device: AC0402FR-0791KL; LCSC Part Name: 厚膜电阻 91kΩ ±1% 62.5mW; Supplier Part: C144733; Manufacturer Part: AC0402FR-0791KL; Supplier Footprint: 0402; JLCPCB Part Class: Extended Part; Datasheet: https://atta.szlcsc.com/upload/public/pdf/source/20180927/C229861_4ABDC471507C1ED6AFB4BA66AFC8620A.pdf; Supplier: LCSC; Convert to PCB: yes; Type: 厚膜电阻; Value: 91kΩ; Tolerance: ±1%; Operating Temperature Range: -55℃~+155℃; Name: 91kΩ
R28 = 0402WGF1001TCE: Resistor, Res Thick Film 0402 1K Ohm 1% 0.063W(1/16W) ±100ppm/°C Pad SMD T/R; Manufacturer: UNI-ROYAL(厚声); Add into BOM: yes; Power(Watts): 62.5mW; Overload Voltage (Max): 50V; Temperature Coefficient: ±100ppm/℃; Value: 1kΩ; Symbol: 0402WGF1001TCE; Device: 0402WGF1001TCE; Supplier: LCSC; Manufacturer Part: 0402WGF1001TCE; Supplier Part: C11702; JLCPCB Part Class: 基础库; LCSC Part Name: 1kΩ ±1% 62.5mW 厚膜电阻; Supplier Footprint: 0402; Datasheet: https://atta.szlcsc.com/upload/public/pdf/source/20200306/C422600_1E6D84923E4A46A82E41ADD87F860B5C.pdf; Convert to PCB: yes; Type: 厚膜电阻; Tolerance: ±1%; Operating Temperature Range: -55℃~+155℃; Resistance: 1kΩ; Name: =Value
SW1-SW3 = MST-22D18G2 3J: Slide Switch, Surface Mount, Operating Temperature: -30°C to +80°C, Switch Width: 3.6mm, Switch Length: 9.1mm, Switch Color: -, Switch Height: 3.45mm, Pin Style: SMD Tab, Mechanical Life: 10,000 cycles, Actuator Shape: -, Circuit Configuration: Single Pole Double Throw, Rated Voltage (AC): -, Rated Voltage (DC): 12V, Rated Current (AC): -, Rated Current (DC): 50mA.; Manufacturer: SHOU HAN(首韩); Symbol: MST-22D18G2 3J_C2875122; Add into BOM: yes; Circuit: 单刀双掷; Pin Style: SMD接片; Current Rating (DC): 50mA; Mechanical Life: 1万次; Device: MST-22D18G2 3J; Supplier: LCSC; Supplier Part: C2875122; Manufacturer Part: MST-22D18G2 3J; JLCPCB Part Class: 扩展库; LCSC Part Name: 拨动开关 2档3脚立式贴片 柄高2MM 9.1*3.5*2.0mm; Supplier Footprint: SMD; Convert to PCB: yes; Actuator Style: -; Switch Length: 9.1mm; Switch Width: 3.6mm; Switch Height: 3.45mm; Mounting Style: 立贴; Actuator Color: -; Voltage Rating (DC): 12V; Current Rating (AC): -; Voltage Rating (AC): -; Operating Temperature: -30℃~+80℃; Name: MST-22D18G2 3J
TP1-TP20 TP41 = Test_Point: Value: Test point
U1 = BQ27427YZFR: Single-cell battery fuel gauge with pre-programmed chemistry and integrated sense resistor 9-DSBGA -40 to 85; Manufacturer: TI(德州仪器); Add into BOM: yes; Type of Battery: 锂离子/聚合物; Number of Cells: 1; Symbol: BQ27427YZFR; Device: BQ27427YZFR; Supplier: LCSC; Supplier Part: C6075475; Manufacturer Part: BQ27427YZFR; JLCPCB Part Class: 扩展库; LCSC Part Name: BQ27427YZFR; Supplier Footprint: DSBGA-9; Datasheet: https://atta.szlcsc.com/upload/public/pdf/source/20230606/EC4A78E98B698DBC5F6AAC887FB11355.pdf; Convert to PCB: yes; Name: BQ27427YZFR
U2 = BQ25302RTER: Standalone single cell 2.0-A buck battery charger 16-WQFN -40 to 85; Manufacturer: TI(德州仪器); Add into BOM: yes; Supply Voltage: 6.2V; Maximum Charge Current: 2A; Type of Battery: 锂离子/聚合物; Number of Cells: 1; Symbol: BQ25302RTER; Device: BQ25302RTER; LCSC Part Name: BQ25302RTER; Supplier Part: C2761617; Manufacturer Part: BQ25302RTER; Supplier Footprint: WQFN-16-EP(3x3); JLCPCB Part Class: 扩展库; Datasheet: https://www.ti.com/cn/lit/gpn/bq25302; Supplier: LCSC; Convert to PCB: yes; Operating Temperature: -40℃~+85℃; Name: BQ25302RTER
U3 = USBLC6-2SC6: 17V Clamp 5A (8/20Âµs) Ipp Tvs Diode Surface Mount SOT-23-6; MF: STMicroelectronics; Value: *; SnapEDA_Link: https://www.snapeda.com/parts/USBLC6-2SC6/STMicroelectronics/view-part/?ref=snap; Check_prices: https://www.snapeda.com/parts/USBLC6-2SC6/STMicroelectronics/view-part/?ref=eda; Purchase-URL: https://pricing.snapeda.com/search/part/USBLC6-2SC6/?ref=eda; Price: None; Availability: In Stock; Package: SOT-23-6 STMicroelectronics; MP: USBLC6-2SC6
U4 = TPS22965DSGR: Tape & Reel (TR) TPS22965 e4 On/Off power distribution switch 2mm 2.5V 2.2ms 6A; Manufacturer: TI(德州仪器); Add into BOM: yes; Symbol: TPS22965DSGR; Device: TPS22965DSGR; Supplier: LCSC; Manufacturer Part: TPS22965DSGR; Supplier Part: C122837; JLCPCB Part Class: 扩展库; LCSC Part Name: TPS22965DSGR; Supplier Footprint: UDFN-8-EP(2x2); Datasheet: https://www.ti.com/cn/lit/gpn/tps22965; Convert to PCB: yes; Name: TPS22965DSGR
U5 = TPS61023DRLR: 3.7-A boost converter with 0.5-V ultra-low input voltage 6-SOT-5X3 -40 to 125
U6 = TPS63806YFFR: Low IQ Buck-Boost Converter with Small Solution Size 2A 1.3V to 5.5V 15-Pin DSBGA
U7 = TLV70218DBVR: 300-mA, high-PSRR, low-IQ, low-dropout voltage regulator with enable 5-SOT-23 -40 to 125; Quiescent Current: 30uA; Accuracy: 2%; Dropout Voltage: 260mV; Output Voltage Accuracy: 0.5%; Max Input Voltage: 5.5V; Max Output Current: 300mA; Power Dissipation: 500mW; Number of Regulators: 1; Min Output Voltage: 1.8V; Min Input Voltage: 2V; Min Current Limit: 320mA; Polarity: Positive; Output Type: Fixed; Package Quantity: 3000; Packaging: Tape and Reel; Contact Plating: Gold; RoHS Compliant: Yes; Min Operating Temperature: -40°C; Number of Outputs: 1; REACH SVHC: No SVHC; Lead Free: Lead Free; Max Operating Temperature: 125°C; Series: -; Case/Package: SOT-23-5; Radiation Hardening: No; Nominal Output Voltage: 1.8V; Number of Pins: 5; Max Output Voltage: 1.8V; Output Current: 300mA; Max Power Dissipation: 500mW; Output Voltage: 1.8V

## Nets that join several sheets
+1.8V: hand_main_v2 (15 pins), hand_pdn_v2 (C25.2 TP20.TP? U7.5)
+3.3V: hand_main_v2 (54 pins), hand_pdn_v2 (11 pins)
+5V: hand_main_v2 (U28.A2 U29.A2 U30.A2 U31.A2), hand_pdn_v2 (6 pins)
+VBUS: hand_main_v2 (J4.18 R54.1), hand_pdn_v2 (9 pins)
BAT+: hand_main_v2 (J4.16 R50.2 R51.1), hand_pdn_v2 (5 pins)
GND: hand_main_v2 (105 pins), hand_pdn_v2 (59 pins)
BQ25302_STAT: hand_main_v2 (U26.4), hand_pdn_v2 (R10.1 U2.3)
BQ27427_GPOUT: hand_main_v2 (U26.2), hand_pdn_v2 (R3.1 TP3.TP? U1.A1)
ESP_USB_N: hand_main_v2 (R44.2), hand_pdn_v2 (U3.3)
ESP_USB_P: hand_main_v2 (R45.2), hand_pdn_v2 (U3.1)
FPC_BOARD_SCL: hand_main_v2 (8 pins), hand_pdn_v2 (U1.A3)
FPC_BOARD_SDA: hand_main_v2 (6 pins), hand_pdn_v2 (U1.A2)
TCA_BQ25302_EN: hand_main_v2 (U26.3), hand_pdn_v2 (R9.2)